# Altium schematic sheet system-schematic.schdoc
size 293 x 214 mm
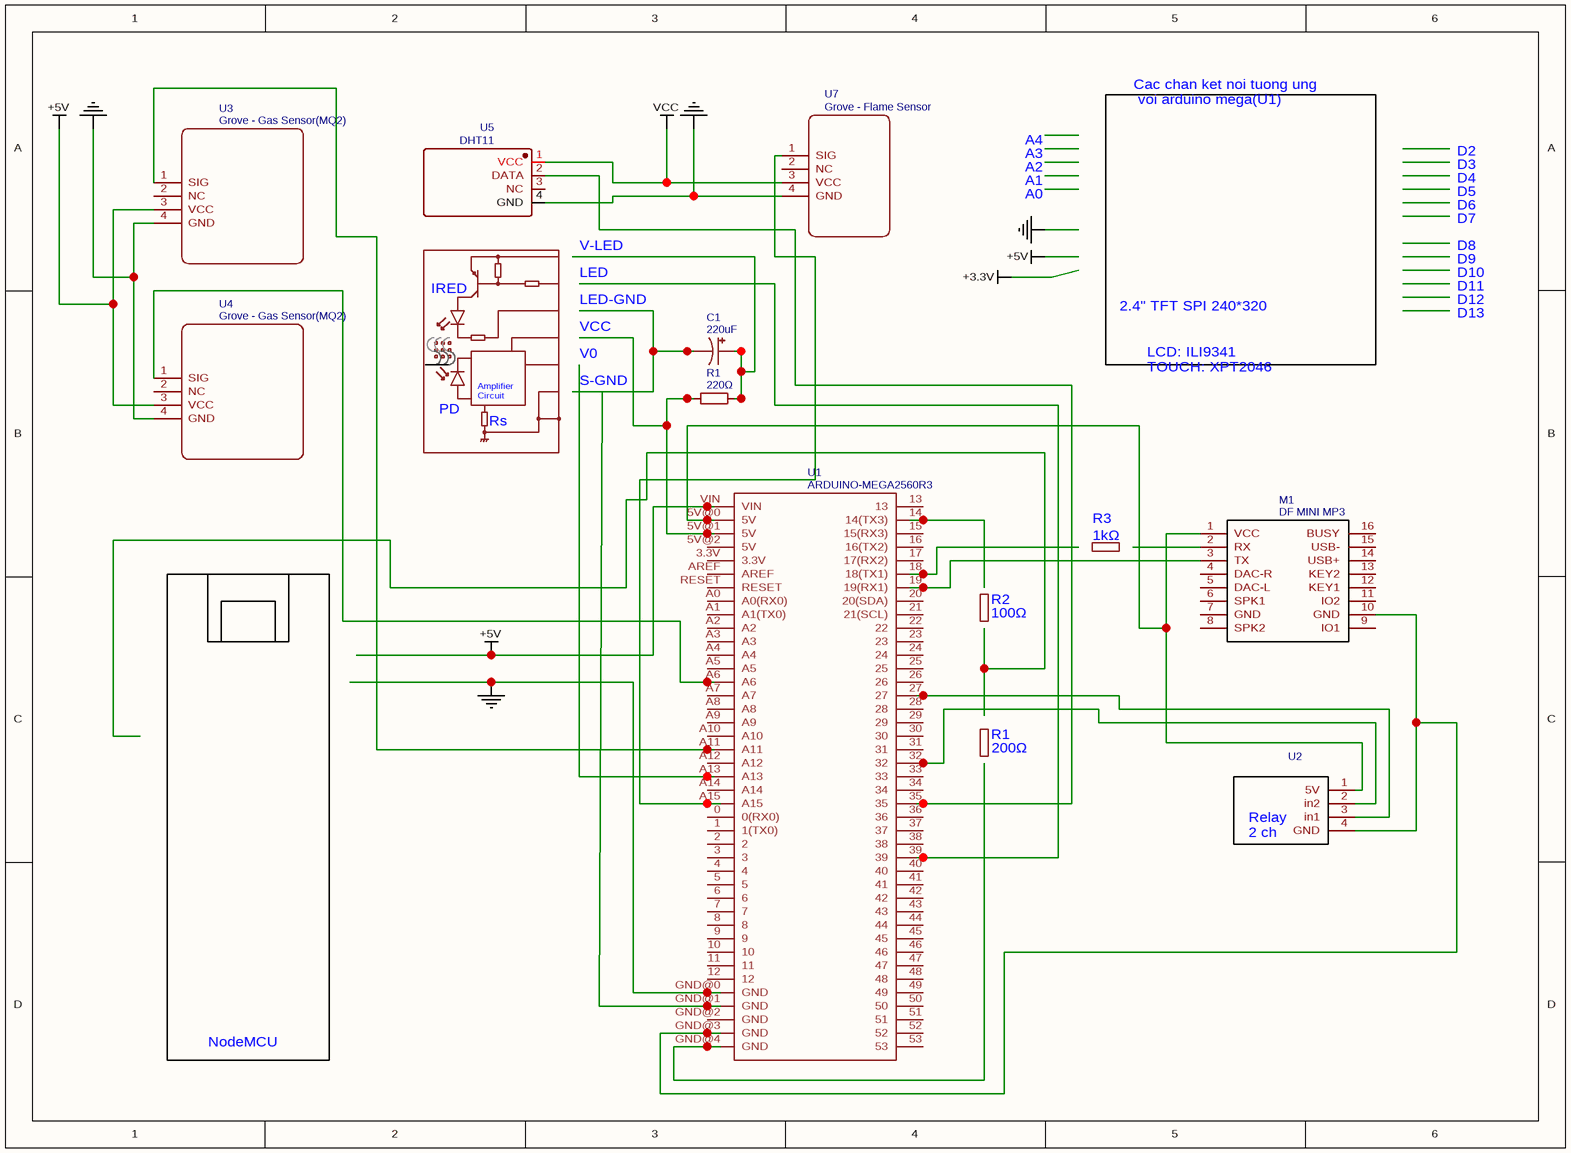
[diagram p0: system-schematic.schdoc]

## Parts
C1  220uF  [CAP-D3.0XF1.5]
M1  DF MINI MP3  [DF MINI MP3]
R1  220Ω  [AXIAL-0.3]
U1  ARDUINO-MEGA2560R3  [ARDUINO_MEGA-PRO-5V]
U2  NO  [RELAY MODULE 2 CHANEL]  (value not drawn)
U3  Grove - Gas Sensor(MQ2)  [GROVE - GAS SENSOR(MQ2)]
U4  Grove - Gas Sensor(MQ2)  [GROVE - GAS SENSOR(MQ2)]
U5  DHT11  [DHT11]
U7  Grove - Flame Sensor  [GROVE - FLAME SENSOR]

## Nets
+5V: U1.VIN U3.3(VCC) U4.3(VCC)
GND: U1.GND@0(GND) U3.4(GND) U4.4(GND) U5.4(GND) U7.4(GND)
VCC: U5.1(VCC) U7.3(VCC)
NetC1_2: C1.2 U1.GND@1(GND)
NetM1_1: M1.1(VCC) U1.5V@0(5V) U2.1(5V)
NetM1_3: M1.3(TX) U1.19(19(RX1))
NetM1_10: M1.10(GND) U1.GND@3(GND) U2.4(GND)
NetU1_27: U1.27 U2.3(in1)
NetU1_32: U1.32 U2.2(in2)
NetU1_35: U1.35 U5.2(DATA)
NetU1_A6: U1.A6 U4.1(SIG)
NetU1_A11: U1.A11 U3.1(SIG)
NetU1_A15: U1.A15 U7.1(SIG)

Not connected (* = marked no-connect by the designer): C1 1; M1 2(RX) 4(DAC-R) 5(DAC-L) 6(SPK1) 7(GND) 8(SPK2) 9(IO1) 11(IO2) 12(KEY1) 13(KEY2) 14(USB+) 15(USB-) 16(BUSY); R1 1 2; U1 0(0(RX0)) 1(1(TX0)) 2 3 3.3V 4 5 5V@1(5V) 5V@2(5V) 6 7 8 9 10 11 12 13 14(14(TX3)) 15(15(RX3)) 16(16(TX2)) 17(17(RX2)) 18(18(TX1)) 20(20(SDA)) 21(21(SCL)) 22 23 24 25 26 28 29 30 31 33 34 36 37 38 39 40 41 42 43 44 45 46 47 48 49 50 51 52 53 A0(A0(RX0)) A1(A1(TX0)) A2 A3 A4 A5 A7 A8 A9 A10 A12 A13 A14 AREF GND@2(GND) GND@4(GND) RESET; U3 2(NC); U4 2(NC); U5 3(NC); U7 2(NC)

## Notes on the sheet
- Cac chan ket noi tuong ung
  voi arduino mega(U1)
- A4
- A3
- D2
- A2
- A1
- A0
- D3
- D4
- D5
- D6
- D7
- IRED
- V-LED
- LED
- D8
- D9
- D10
- D11
- LED-GND
- VCC
- V0
- 2.4" TFT SPI 240*320
- LCD: ILI9341
  TOUCH: XPT2046
- D12
- D13
- PD
- Amplifier
  Circuit
- Rs
- S-GND
- R3
- 1kΩ
- R2
- 100Ω
- R1
- 200Ω
- NodeMCU
- (in symbol NO) Relay / 2 ch

## Library data of the parts
C1 = 220uF: nameAlias: Value(F); BOM_Manufacturer Part: ?; spicePre: C; spiceSymbolName: Cap_Electrolytic(TH)_D3.0XF1.5_US
M1 = DF MINI MP3: BOM_Manufacturer Part: New SchematicLib; Contributor: grichm; spicePre: M
R1 = 220Ω: nameAlias: Value(Ω); BOM_Manufacturer Part: ?; spicePre: R; spiceSymbolName: Res_AXIAL-0.3(1/8W)_EU
U1 = ARDUINO-MEGA2560R3: description: Arduino Mega board footprint; Contributor: SparkFun; BOM_Manufacturer Part: ?; spicePre: U
U2 = NO: nameAlias: Model; Contributor: rowid; spicePre: X; BOM_Manufacturer Part: ?
U3 U4 = Grove - Gas Sensor(MQ2): sourceId: ACwqI0izt; timeStamp: 1464243794; BOM_Supplier Part: undefined; BOM_Supplier: SeeedStudio; BOM_Manufacturer Part: ?; spicePre: U
U5 = DHT11: BOM_Manufacturer: Aosong (Guangzhou) Elec; Contributor: LCSC; BOM_Supplier: LCSC; BOM_Supplier Part: C117051; BOM_Manufacturer Part: DHT11; spicePre: U
U7 = Grove - Flame Sensor: sourceId: z75rNwSCY; timeStamp: 1465034277; BOM_Supplier Part: undefined; BOM_Supplier: SeeedStudio; BOM_Manufacturer Part: ?; spicePre: U